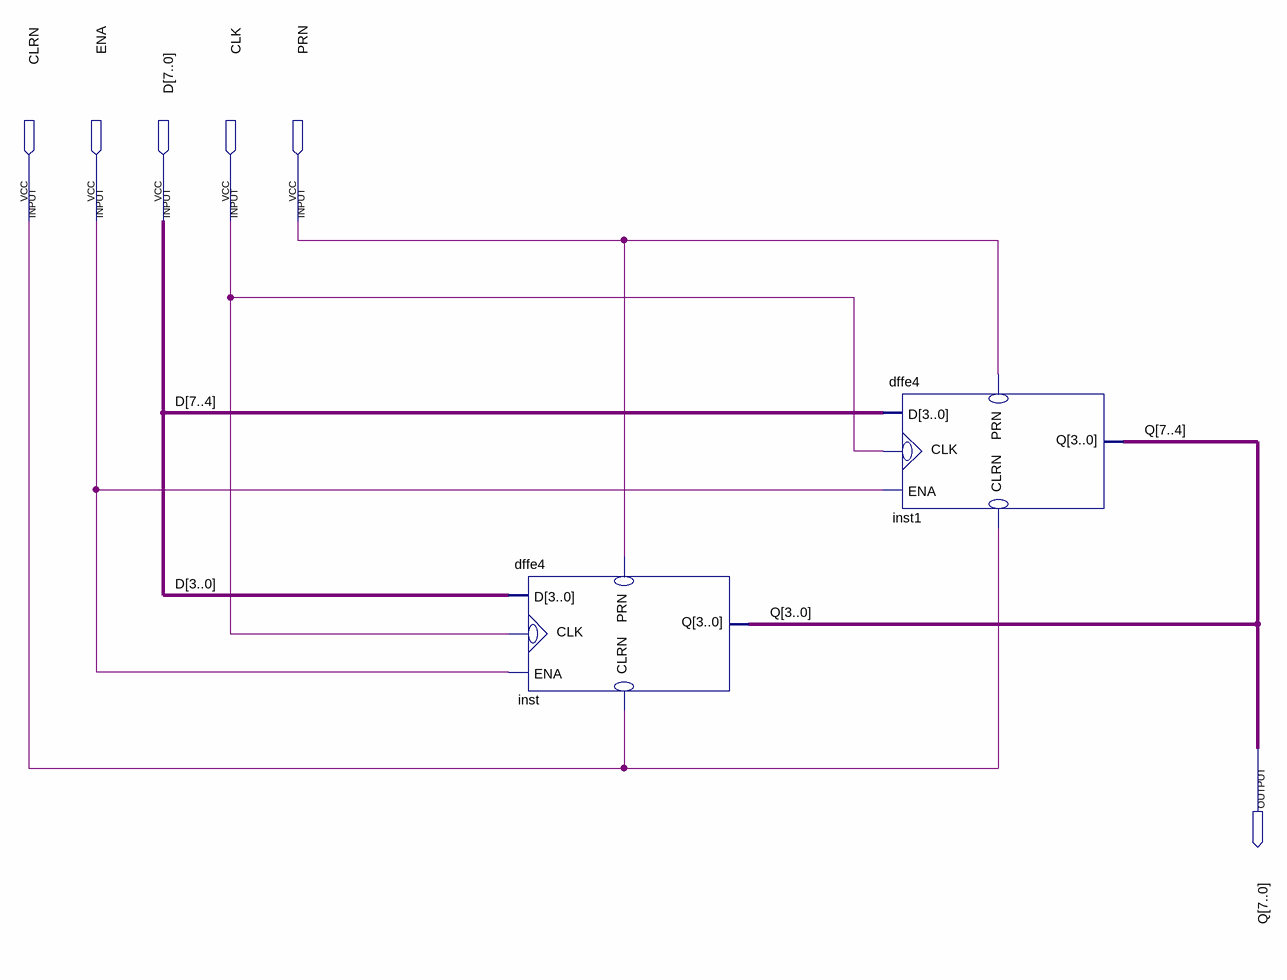
[diagram p0: schematic sheet]
// Quartus schematic dffe8.bdf as structural Verilog: 2 symbols, 6 pins
module dffe8 (
  input  CLRN,
  input  ENA,
  input  [7:0] D,
  input  CLK,
  input  PRN,
  output [7:0] Q
);

  dffe4 inst (.ENA(ENA), .CLRN(CLRN), .PRN(PRN), .D(D[3:0]), .CLK(CLK), .Q(Q[3:0]));
  dffe4 inst1 (.ENA(ENA), .CLRN(CLRN), .PRN(PRN), .D(D[7:4]), .CLK(CLK), .Q(Q[7:4]));
endmodule
